# Altium project Hand Sterile System.PrjPcb
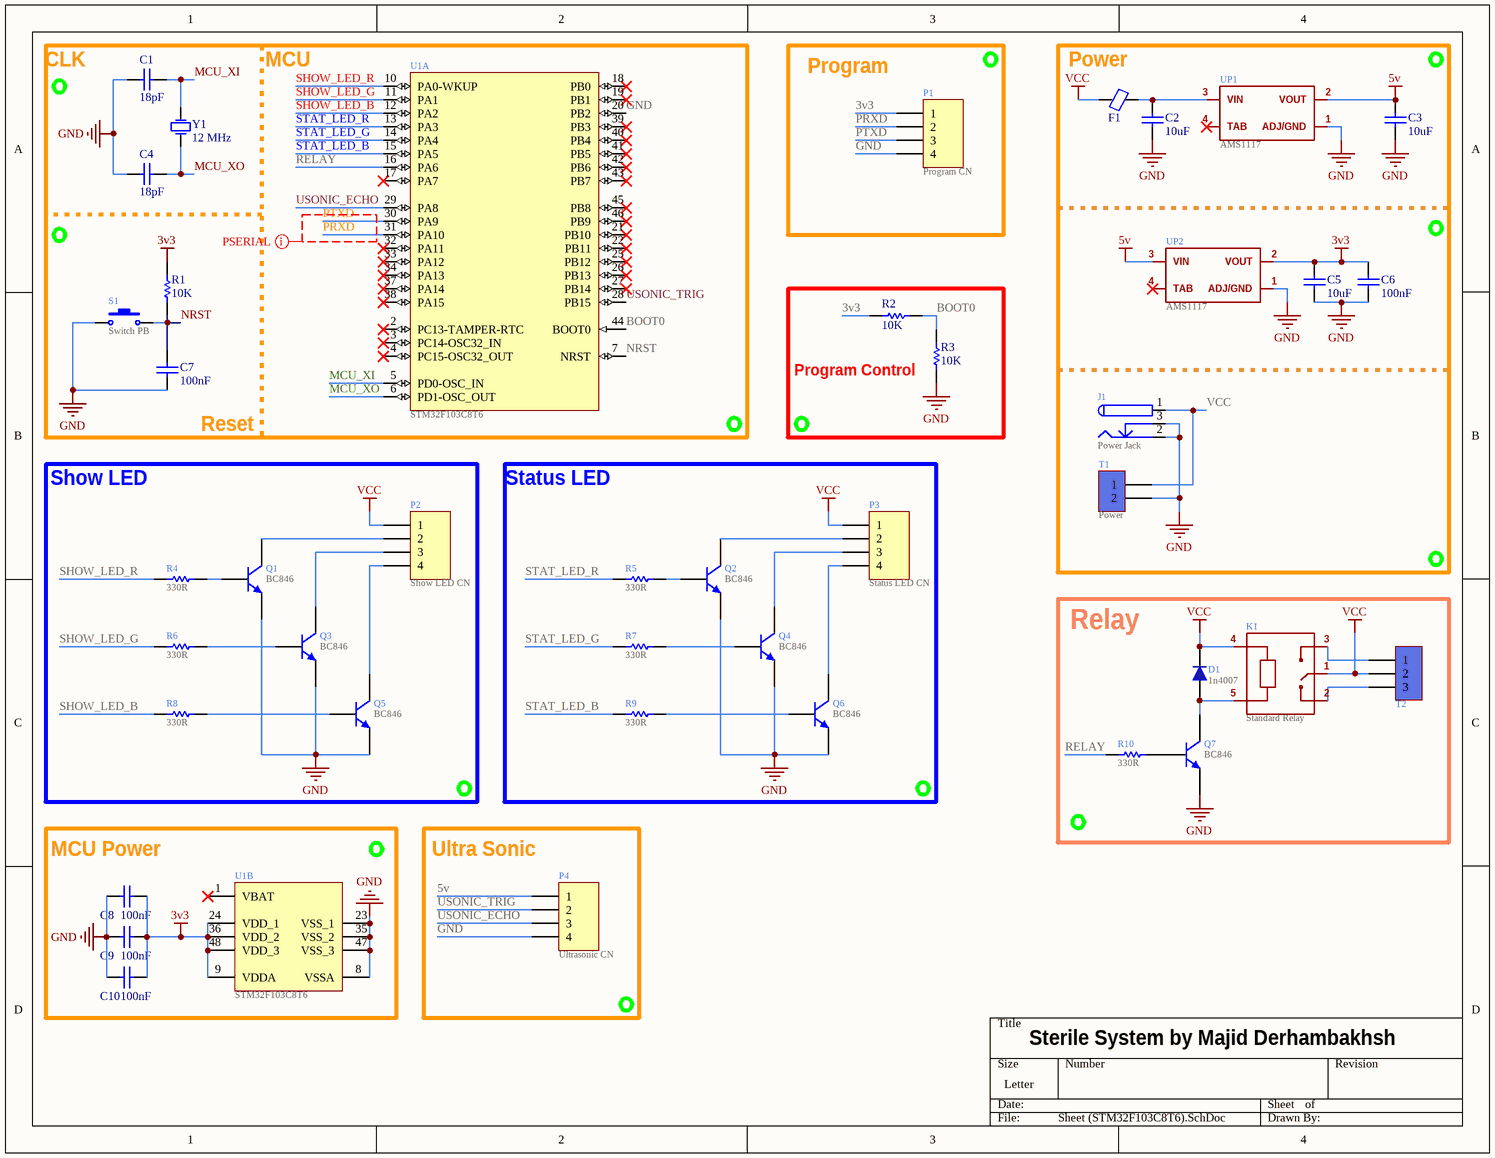
[diagram p0: Sheet (STM32F103C8T6).SchDoc]
1 sheet, 42 parts. Net scope: global (net labels, ports and power ports of the same name join across sheets).
Board file: PCB (STM32F103C8T6).PcbDoc

## Sheet Sheet (STM32F103C8T6).SchDoc
size Letter

### Parts
C1  18pF  [CAP805]
C2  10uF  [Cap1206_(3216X15)]
C3  10uF  [Cap1206_(3216X15)]
C4  18pF  [CAP805]
C5  10uF  [Cap1206_(3216X15)]
C6  100nF  [Cap1206_(3216X15)]
C7  100nF  [Cap1206_(3216X15L)]
C8  100nF  [Cap1206_(3216X15L)]
C9  100nF  [Cap1206_(3216X15L)]
C10  100nF  [Cap1206_(3216X15L)]
D1  1n4007  [DIOM4629X24N]
F1  Ferrite Bead SMD  [FB1206]  (value not drawn)
J1  Power Jack  [DC Power Jack]
K1  Standard Relay  [BABY Milon Relay (15.40x12.10x13.10)]
P1  Program CN  [HDR1X4]
P2  Show LED CN  [HDR1X4]
P3  Status LED CN  [HDR1X4]
P4  Ultrasonic CN  [HDR1X4]
Q1  BC846  [SOT23_L]
Q2  BC846  [SOT23_L]
Q3  BC846  [SOT23_L]
Q4  BC846  [SOT23_L]
Q5  BC846  [SOT23_L]
Q6  BC846  [SOT23_L]
Q7  BC846  [SOT23_L]
R1  10K  [RES1206 _(3216X08L)]
R2  10K  [RES1206 _(3216X08L)]
R3  10K  [RES1206 _(3216X08L)]
R4  330R  [RES1206 _(3216X08L)]
R5  330R  [RES1206 _(3216X08L)]
R6  330R  [RES1206 _(3216X08L)]
R7  330R  [RES1206 _(3216X08L)]
R8  330R  [RES1206 _(3216X08L)]
R9  330R  [RES1206 _(3216X08L)]
R10  330R  [RES1206 _(3216X08L)]
S1  Switch PB  [Switch - Push to On]
T1  Power  [KF301 2PIN]
T2  KF301_Terminal  [KF301 3PIN]  (value not drawn)
U1  STM32F103C8T6  [STM-LQFP48_M]  (parts A,B of 2)
UP1  AMS1117  [SOT223]
UP2  AMS1117  [SOT223]
Y1  12 MHz  [XTAL 16MHZ]

### Blocks framed on the sheet
Program: P1
Power: C2 C3 C5 C6 F1 J1 T1 UP1 UP2
Program Control: R2 R3
Show LED: P2 Q1 Q3 Q5 R4 R6 R8
Status LED: P3 Q2 Q4 Q6 R5 R7 R9
Relay: D1 K1 Q7 R10 T2
MCU Power: C8-C10 U1
Ultra Sonic: P4

### Nets
3v3: C5.2 C6.2 C8.2 C9.2 C10.2 P1.1 R1.2 R2.2 U1.9(VDDA) U1.24(VDD_1) U1.36(VDD_2) U1.48(VDD_3) UP2.2(VOUT)
5v: C3.2 P4.1 UP1.2(VOUT) UP2.3(VIN)
GND: C1.2 C2.1 C3.1 C4.2 C5.1 C6.1 C7.1 C8.1 C9.1 C10.1 J1.2 J1.3 P1.4 P4.4 Q1.2(E) Q2.2(E) Q3.2(E) Q4.2(E) Q5.2(E) Q6.2(E) Q7.2(E) R3.1 S1.1 T1.2 U1.8(VSSA) U1.20(PB2) U1.23(VSS_1) U1.35(VSS_2) U1.47(VSS_3) UP1.1(ADJ/GND) UP2.1(ADJ/GND)
VCC: D1.2 F1.2 J1.1 K1.1(COM) K1.4(A) P2.1 P3.1 T1.1 T2.2
BOOT0: R2.1 R3.2 U1.44(BOOT0)
MCU_XI: C1.1 U1.5(PD0-OSC_IN) Y1.2(OSC2)
MCU_XO: C4.1 U1.6(PD1-OSC_OUT) Y1.1(OSC1)
NRST: C7.2 R1.1 S1.2 U1.7(NRST)
PRXD: P1.2 U1.31(PA10)
PTXD: P1.3 U1.30(PA9)
RELAY: R10.1 U1.16(PA6)
SHOW_LED_B: R8.1 U1.12(PA2)
SHOW_LED_G: R6.1 U1.11(PA1)
SHOW_LED_R: R4.1 U1.10(PA0-WKUP)
STAT_LED_B: R9.1 U1.15(PA5)
STAT_LED_G: R7.1 U1.14(PA4)
STAT_LED_R: R5.1 U1.13(PA3)
USONIC_ECHO: P4.3 U1.29(PA8)
USONIC_TRIG: P4.2 U1.28(PB15)
NetC2_2: C2.2 F1.1 UP1.3(VIN)
NetD1_1: D1.1 K1.5(A) Q7.3(C)
NetK1_2: K1.2(N.C) T2.3
NetK1_3: K1.3(N.O) T2.1
NetP2_2: P2.2 Q1.3(C)
NetP2_3: P2.3 Q3.3(C)
NetP2_4: P2.4 Q5.3(C)
NetP3_2: P3.2 Q2.3(C)
NetP3_3: P3.3 Q4.3(C)
NetP3_4: P3.4 Q6.3(C)
NetQ1_1: Q1.1(B) R4.2
NetQ2_1: Q2.1(B) R5.2
NetQ3_1: Q3.1(B) R6.2
NetQ4_1: Q4.1(B) R7.2
NetQ5_1: Q5.1(B) R8.2
NetQ6_1: Q6.1(B) R9.2
NetQ7_1: Q7.1(B) R10.2

Not connected (* = marked no-connect by the designer): U1 1(VBAT)* 2(PC13-TAMPER-RTC)* 3(PC14-OSC32_IN)* 4(PC15-OSC32_OUT)* 17(PA7)* 18(PB0)* 19(PB1)* 21(PB10)* 22(PB11)* 25(PB12)* 26(PB13)* 27(PB14)* 32(PA11)* 33(PA12)* 34(PA13)* 37(PA14)* 38(PA15)* 39(PB3)* 40(PB4)* 41(PB5)* 42(PB6)* 43(PB7)* 45(PB8)* 46(PB9)*; UP1 4(TAB)*; UP2 4(TAB)*

### Layout directives
mark named PSERIAL: PRXD, PTXD

### Notes on the sheet
- CLK
- MCU
- (near C7) Reset
- Sterile System by Majid Derhambakhsh

### Library data of the parts
C1 C4 C6-C10 = CAP SMD PACKAGE: TOTAL CAPACITOR SMD PACK; Designer: Majid Derhambakhsh; Desc.: CAP SMD TOTAL PACKAGES; Data: 2017-3-10
  C1 C4: VALUE: 18pF
  C6-C10: VALUE: 100nF
C2 C3 C5 = CAP SMD PACKAGE: TOTAL CAPACITOR SMD PACK; Designer: Abbas Basereh; Desc.: CAP SMD TOTAL PACKAGES; Data: 2017-3-10; VALUE: 10uF
D1 = 1n4007 SMD M7: Standard Rectifiers; Part. No: M7; Manufacturer: DC COMPONENTS; Designer: Abbas Basereh; Link: http://www.tme.eu/en/details/m7/smd-universal-diodes/dc-components/; Link: https://www.aliexpress.com/item/Smd-tube-1n4007-m7-SMA/1213719741.html?spm=2114.01010208.3.1.ZyZ7bC&ws_ab_test=searchweb0_0,searchweb201602_4_10065_10068_10084_10083_10080_10082_10081_10060_10061_10062_10056_10055_10054_10059_10099_10078_10079_427_10073_10103_10102_10096_10052_10050_10051,searchweb201603_4&btsid=db2be5ca-e560-400a-b91c-484ab5ee228b; Data: 16-12-2016
F1 = Ferrite Bead SMD Package: Designer: Ali Hafizi
J1 = DC Power Jack: Designer: Majid Derhambakhsh
K1 = Relay: Relay SPDT POWER NEEDLE; Designer: Ali Hafizi; Company: E.P.I.L; Design_Date: 2011/10/31
P1-P4 = Header 4: Header, 4-Pin; LatestRevisionDate: 17-Jul-2002; LatestRevisionNote: Re-released for DXP Platform.; Publisher: Altium Limited
Q1-Q7 = BC846: NPN General-purpose Transistor; Published: 2017-1-6; LatestRevisionDate: 12-Dec-2006; LatestRevisionNote: IPC-7351 Footprint Added.; DatasheetVersion: 4-Feb-2002; PackageVersion: 2017-1-6; PackageReference: SOT23; Publisher: Abbas Basereh; PackageDescription: 3-Pin SOT-23 Package 0.95 mm Pitch, 2.3 mm Lead Span; ComponentLink1Description: Manufacturer Link; ComponentLink1URL: http://www.semiconductors.philips.com/; ComponentLink2Description: Datasheet; ComponentLink2URL: http://www.semiconductors.philips.com/acrobat/datasheets/BC846_BC847_BC848_5.pdf
R1-R10 = RES SMD PACKAGE: TOTAL SMD RESISTOR PACK; Designer: Abbas Basereh; Desc.: RES SMD PAKAGES; Data: 2017-3-10
S1 = Switch PB: Push Button Switch
T1 = KF301-2Pin_Terminal: Terminal 2 Pin 250VAC 16A; Part. No: KF301 2P; Designer: Abbas Basereh; Link: https://www.aliexpress.com/item/
T2 = KF301-3Pin_Terminal: Terminal 3 Pin 250VAC 16A; Part. No: KF301 3P; Designer: Abbas Basereh; Link: https://www.aliexpress.com/item/
U1 = STM32F103C8T6: ARM Cortex-M3 32-bit MCU, 64 KB Flash, 20 KB Internal RAM, 37 I/Os, 48-pin LQFP, -40 to 85 degC, Tray; A/D Converter: 2x12-bit (10 Channel); FLASH Size (Prog) (kB): 64; I/Os (High Current): 37; Internal RAM Size (kB): 20; Operating Frequency(F) (Processor speed) (MHz): 72; Supply Voltage(Vcc) min (V): 2; DatasheetVersion: Rev. 16; PackageVersion: Rev. 6, 06/2013; PackageReference: LQFP48; PackageDescription: 48-Pin Low Profile Quad Flat Package, 7 x 7 mm Body, 0.5 mm Pitch; Supplier 1: Digi-Key; Supplier Part Number 1: 497-6063-ND; Supplier 2: Farnell; Supplier Part Number 2: 1447637; Supplier 3: Newark; Supplier Part Number 3: 59M2182; Supplier 4: Newark; Supplier Part Number 4: 57P1222; Supplier 5: Mouser; Supplier Part Number 5: 511-STM32F103C8T6; Core: ARM Cortex-M3; Packing: Tray; Mounting Technology: Surface Mount; PartNumber: STM32F103C8T6; ComponentLink1Description: Manufacturer URL; ComponentLink1URL: http://www.st.com/web/en/home.html; ComponentLink2Description: Datasheet; ComponentLink2URL: http://www.st.com/st-web-ui/static/active/en/resource/technical/document/datasheet/CD00161566.pdf; ComponentLink3Description: Package Specification; ComponentLink3URL: http://www.st.com/st-web-ui/static/active/en/resource/technical/document/datasheet/DM00058181.pdf
UP1 UP2 = AMS1117: x.x Volt, 800mA Low-Dropout Linear Regulator, 4-pin SOT-223; Designer: Ali Hafizi; Data: 16-12-2016
Y1 = XTAL: XTAL Crystal; Designer: ABBAS BASEREH; Design Date: 2017-1-3; ComponentLink1Description: Datasheet; ComponentLink2Description: Reference; Mounting Technology: Surface Mount\Through-Hole; Value: 12 MHz; Status: Unreleased